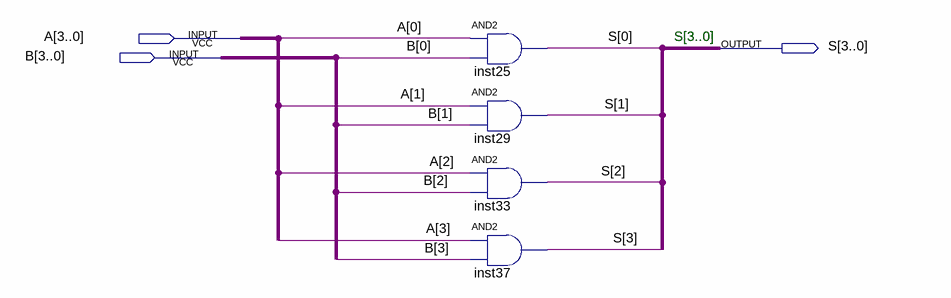
[diagram p0: schematic sheet]
// Quartus schematic AND_4bits.bdf as structural Verilog: 4 symbols, 3 pins
module AND_4bits (
  input  [3:0] A,
  input  [3:0] B,
  output [3:0] S
);

  and inst25 (S[0], A[0], B[0]);
  and inst29 (S[1], A[1], B[1]);
  and inst33 (S[2], A[2], B[2]);
  and inst37 (S[3], A[3], B[3]);

  // Notes on the sheet:
  //   S[3..0]
endmodule
